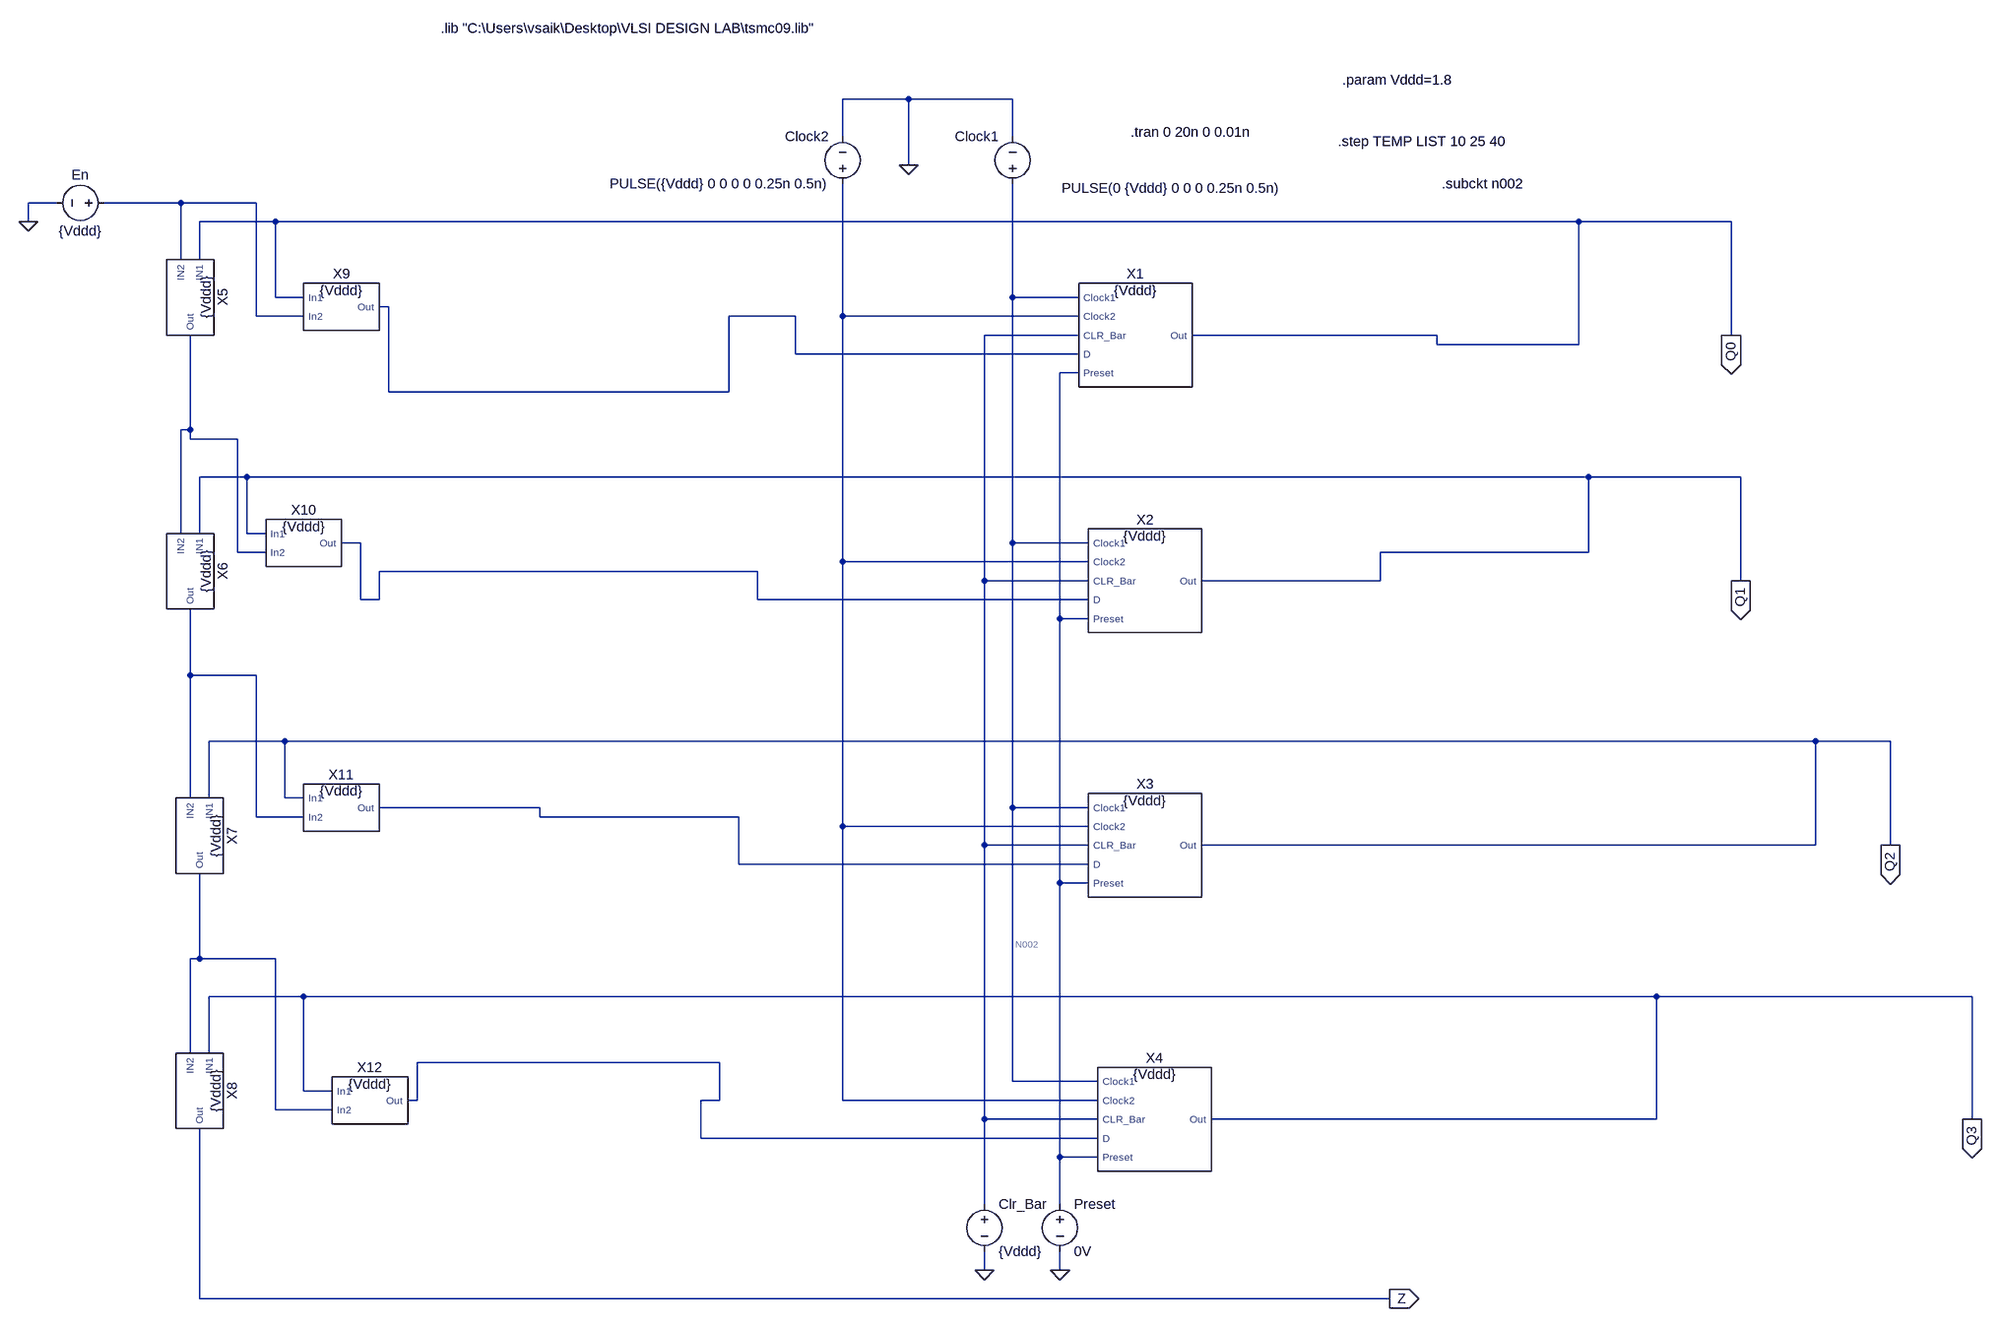
[diagram p0: schematic Counter1_P_Clr2_exper6.asc]
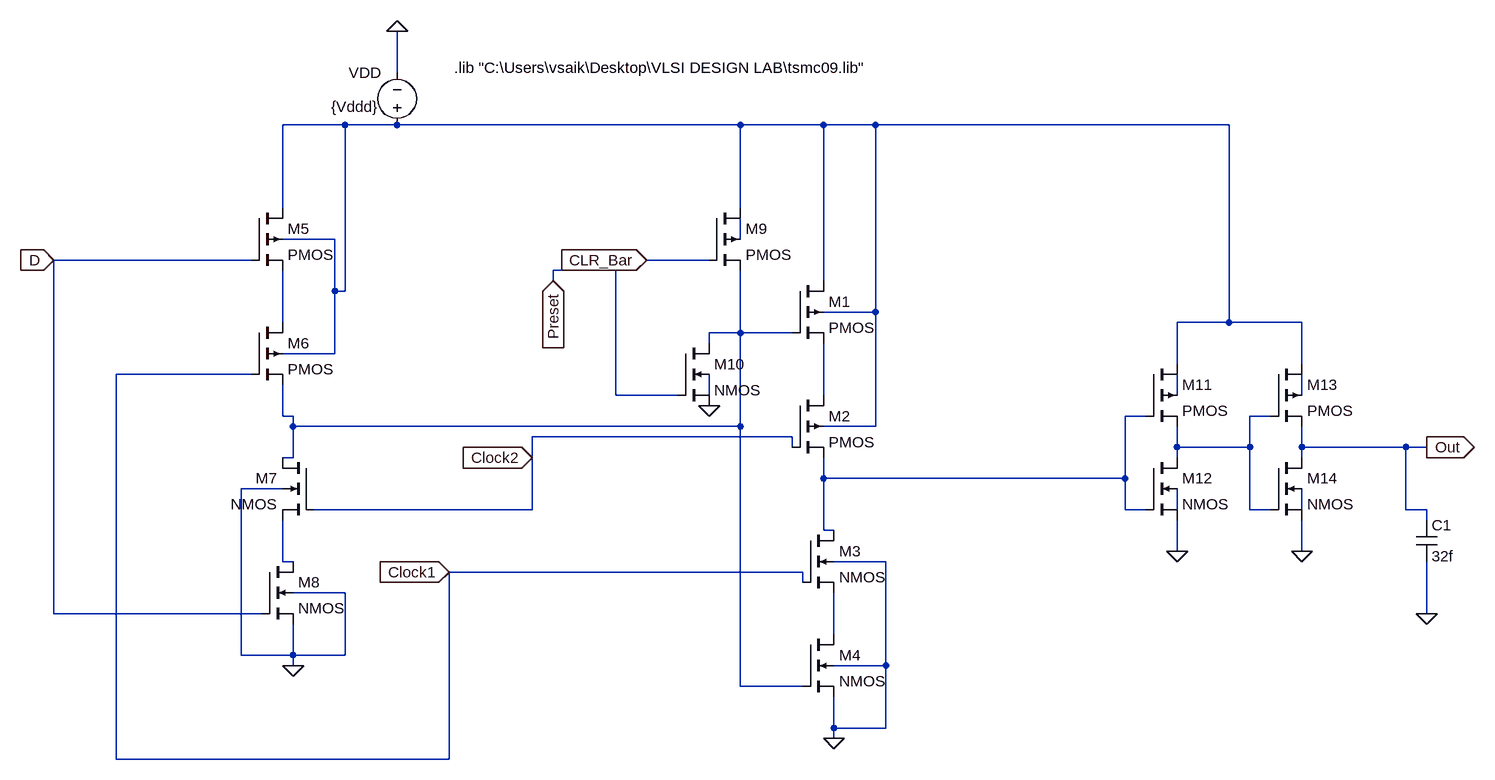
[diagram p1: sub-circuit d_flip_flop_880_440_buffer_pr_clr.asc]
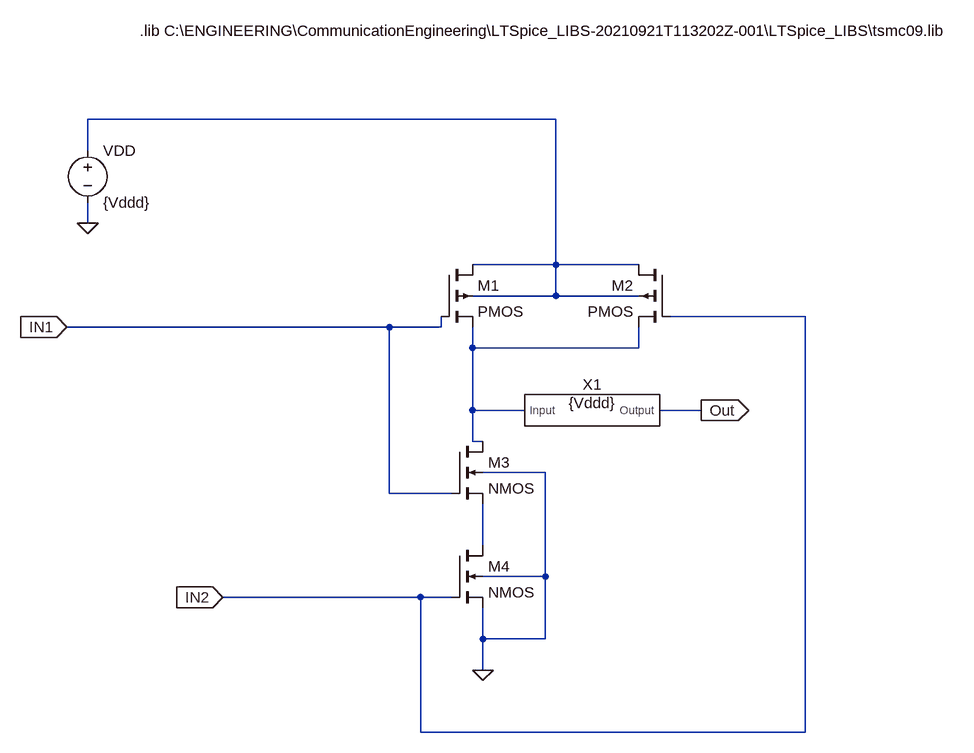
[diagram p2: sub-circuit and_model1.asc]
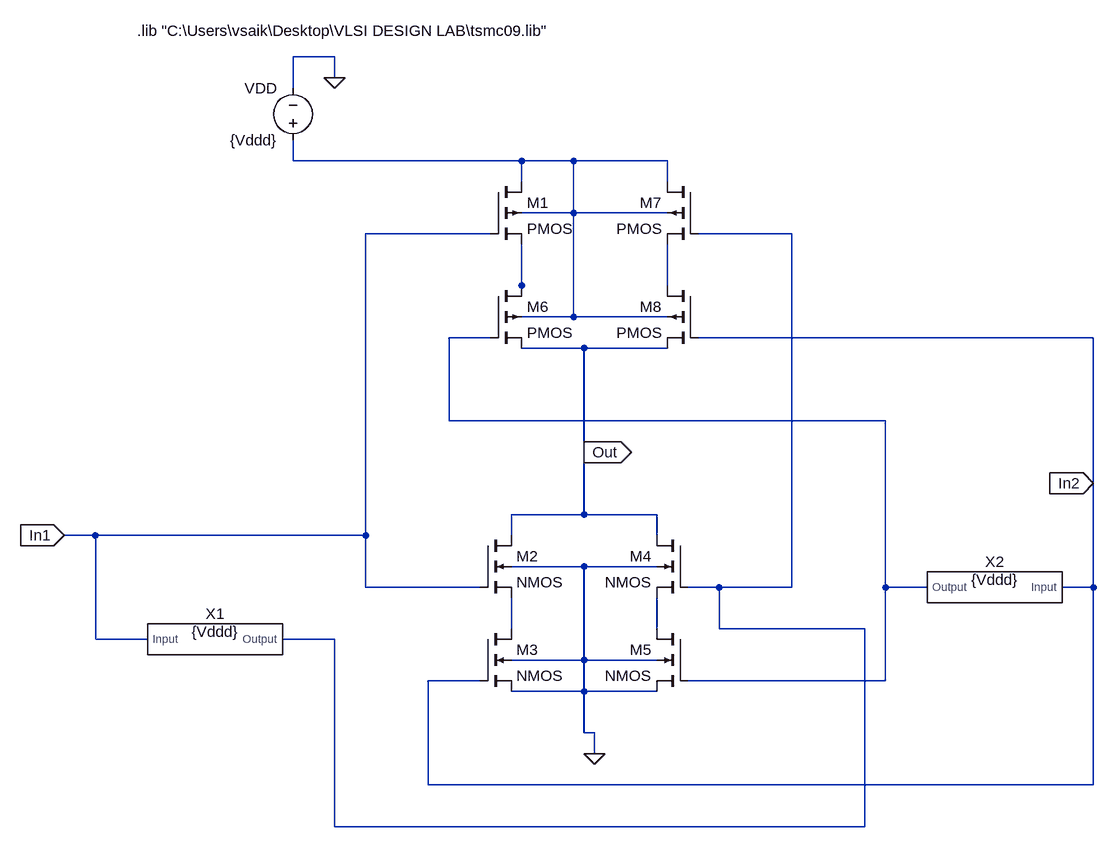
[diagram p3: sub-circuit xor_model1.asc]
Counter1_P_Clr2_exper6.asc, the LTspice schematic file:
Version 4
SHEET 1 3432 2288
WIRE 912 160 800 160
WIRE 1088 160 912 160
WIRE 800 224 800 160
WIRE 1088 224 1088 160
WIRE 912 272 912 160
WIRE -560 336 -608 336
WIRE -320 336 -480 336
WIRE -192 336 -320 336
WIRE -608 368 -608 336
WIRE -160 368 -288 368
WIRE 2128 368 -160 368
WIRE 2464 368 2128 368
WIRE -320 432 -320 336
WIRE -288 432 -288 368
WIRE -160 496 -160 368
WIRE -112 496 -160 496
WIRE 1088 496 1088 304
WIRE 1200 496 1088 496
WIRE 32 512 16 512
WIRE -192 528 -192 336
WIRE -112 528 -192 528
WIRE 720 528 608 528
WIRE 800 528 800 304
WIRE 1200 528 800 528
WIRE 1200 560 1040 560
WIRE 1888 560 1392 560
WIRE 2464 560 2464 368
WIRE 1888 576 1888 560
WIRE 2128 576 2128 368
WIRE 2128 576 1888 576
WIRE 720 592 720 528
WIRE 1200 592 720 592
WIRE 1200 624 1168 624
WIRE 32 656 32 512
WIRE 608 656 608 528
WIRE 608 656 32 656
WIRE -304 720 -304 560
WIRE -304 720 -320 720
WIRE -304 736 -304 720
WIRE -224 736 -304 736
WIRE -208 800 -288 800
WIRE 2144 800 -208 800
WIRE 2480 800 2144 800
WIRE -320 896 -320 720
WIRE -288 896 -288 800
WIRE -208 896 -208 800
WIRE -176 896 -208 896
WIRE -16 912 -48 912
WIRE 1088 912 1088 496
WIRE 1216 912 1088 912
WIRE -224 928 -224 736
WIRE -176 928 -224 928
WIRE 2144 928 2144 800
WIRE 2144 928 1792 928
WIRE 800 944 800 528
WIRE 1216 944 800 944
WIRE 656 960 16 960
WIRE 1040 976 1040 560
WIRE 1216 976 1040 976
WIRE 1792 976 1792 928
WIRE 1792 976 1408 976
WIRE 2480 976 2480 800
WIRE -16 1008 -16 912
WIRE 16 1008 16 960
WIRE 16 1008 -16 1008
WIRE 656 1008 656 960
WIRE 1216 1008 656 1008
WIRE 1168 1040 1168 624
WIRE 1216 1040 1168 1040
WIRE -304 1136 -304 1024
WIRE -192 1136 -304 1136
WIRE -144 1248 -272 1248
WIRE 2720 1248 -144 1248
WIRE 2992 1248 2720 1248
WIRE -304 1344 -304 1136
WIRE -272 1344 -272 1248
WIRE -144 1344 -144 1248
WIRE -112 1344 -144 1344
WIRE 288 1360 16 1360
WIRE 1088 1360 1088 912
WIRE 1216 1360 1088 1360
WIRE -192 1376 -192 1136
WIRE -112 1376 -192 1376
WIRE 288 1376 288 1360
WIRE 624 1376 288 1376
WIRE 800 1392 800 944
WIRE 1216 1392 800 1392
WIRE 1040 1424 1040 976
WIRE 1216 1424 1040 1424
WIRE 2720 1424 2720 1248
WIRE 2720 1424 1408 1424
WIRE 2992 1424 2992 1248
WIRE 624 1456 624 1376
WIRE 1216 1456 624 1456
WIRE 1168 1488 1168 1040
WIRE 1216 1488 1168 1488
WIRE -288 1616 -288 1472
WIRE -288 1616 -304 1616
WIRE -160 1616 -288 1616
WIRE -112 1680 -272 1680
WIRE 2336 1680 -112 1680
WIRE 3360 1680 2336 1680
WIRE -304 1776 -304 1616
WIRE -272 1776 -272 1680
WIRE 592 1792 80 1792
WIRE 1088 1824 1088 1360
WIRE 1232 1824 1088 1824
WIRE -112 1840 -112 1680
WIRE -64 1840 -112 1840
WIRE 80 1856 80 1792
WIRE 80 1856 64 1856
WIRE 592 1856 592 1792
WIRE 592 1856 560 1856
WIRE 800 1856 800 1392
WIRE 1232 1856 800 1856
WIRE -160 1872 -160 1616
WIRE -64 1872 -160 1872
WIRE 1040 1888 1040 1424
WIRE 1232 1888 1040 1888
WIRE 2336 1888 2336 1680
WIRE 2336 1888 1424 1888
WIRE 3360 1888 3360 1680
WIRE 560 1920 560 1856
WIRE 1232 1920 560 1920
WIRE 1168 1952 1168 1488
WIRE 1232 1952 1168 1952
WIRE 1040 2032 1040 1888
WIRE 1168 2032 1168 1952
WIRE 1040 2144 1040 2112
WIRE 1168 2144 1168 2112
WIRE -288 2192 -288 1904
WIRE 1808 2192 -288 2192
FLAG -608 368 0
FLAG 1040 2144 0
FLAG 1168 2144 0
FLAG 912 272 0
FLAG 1808 2192 Z
IOPIN 1808 2192 Out
FLAG 2464 560 Q0
IOPIN 2464 560 Out
FLAG 2480 976 Q1
IOPIN 2480 976 Out
FLAG 2992 1424 Q2
IOPIN 2992 1424 Out
FLAG 3360 1888 Q3
IOPIN 3360 1888 Out
SYMBOL D_Flip_Flop_880_440_buffer_Pr_Clr 1296 560 R0
WINDOW 39 0 -60 Bottom 2
SYMATTR InstName X1
SYMATTR SpiceLine {Vddd}
SYMATTR Prefix ""
SYMATTR Value ""
SYMBOL D_Flip_Flop_880_440_buffer_Pr_Clr 1312 976 R0
WINDOW 39 0 -60 Bottom 2
SYMATTR InstName X2
SYMATTR SpiceLine {Vddd}
SYMATTR Prefix ""
SYMATTR Value ""
SYMBOL D_Flip_Flop_880_440_buffer_Pr_Clr 1312 1424 R0
WINDOW 39 0 -60 Bottom 2
SYMATTR InstName X3
SYMATTR SpiceLine {Vddd}
SYMBOL D_Flip_Flop_880_440_buffer_Pr_Clr 1328 1888 R0
WINDOW 39 0 -60 Bottom 2
SYMATTR InstName X4
SYMATTR SpiceLine {Vddd}
SYMBOL AND_model1 -304 496 R90
WINDOW 39 0 -12 Bottom 2
SYMATTR InstName X5
SYMATTR SpiceLine {Vddd}
SYMBOL AND_model1 -304 960 R90
WINDOW 39 0 -12 Bottom 2
SYMATTR InstName X6
SYMATTR SpiceLine {Vddd}
SYMATTR Prefix ""
SYMATTR Value ""
SYMBOL AND_model1 -288 1408 R90
WINDOW 39 0 -12 Bottom 2
SYMATTR InstName X7
SYMATTR SpiceLine {Vddd}
SYMBOL AND_model1 -288 1840 R90
WINDOW 39 0 -12 Bottom 2
SYMATTR InstName X8
SYMATTR SpiceLine {Vddd}
SYMBOL XOR_model1 -48 512 R0
WINDOW 39 0 -12 Bottom 2
SYMATTR InstName X9
SYMATTR SpiceLine {Vddd}
SYMATTR Prefix ""
SYMATTR Value ""
SYMBOL XOR_model1 0 1856 R0
WINDOW 39 0 -12 Bottom 2
SYMATTR InstName X12
SYMATTR SpiceLine {Vddd}
SYMBOL voltage -464 336 R90
WINDOW 0 -32 56 VBottom 2
WINDOW 3 32 56 VTop 2
WINDOW 123 0 0 Left 0
WINDOW 39 0 0 Left 0
SYMATTR InstName En
SYMATTR Value {Vddd}
SYMBOL voltage 1088 320 R180
WINDOW 0 24 96 Left 2
WINDOW 3 -453 9 Left 2
WINDOW 123 0 0 Left 0
WINDOW 39 0 0 Left 0
SYMATTR InstName Clock1
SYMATTR Value PULSE(0 {Vddd} 0 0 0 0.25n 0.5n)
SYMBOL voltage 800 320 R180
WINDOW 0 24 96 Left 2
WINDOW 3 24 16 Left 2
WINDOW 123 0 0 Left 0
WINDOW 39 0 0 Left 0
SYMATTR InstName Clock2
SYMATTR Value PULSE({Vddd} 0 0 0 0 0.25n 0.5n)
SYMBOL voltage 1168 2016 R0
WINDOW 123 0 0 Left 0
WINDOW 39 0 0 Left 0
SYMATTR InstName Preset
SYMATTR Value 0V
SYMBOL voltage 1040 2016 R0
WINDOW 123 0 0 Left 0
WINDOW 39 0 0 Left 0
SYMATTR InstName Clr_Bar
SYMATTR Value {Vddd}
SYMBOL XOR_model1 -112 912 R0
WINDOW 39 0 -12 Bottom 2
SYMATTR InstName X10
SYMATTR SpiceLine {Vddd}
SYMBOL XOR_model1 -48 1360 R0
WINDOW 39 0 -12 Bottom 2
SYMATTR InstName X11
SYMATTR SpiceLine {Vddd}
TEXT 120 40 Left 2 !.lib "C:\\Users\\vsaik\\Desktop\\VLSI DESIGN LAB\\tsmc09.lib"
TEXT 1288 216 Left 2 !.tran 0 20n 0 0.01n
TEXT 1720 232 Left 2 !.step TEMP LIST 10 25 40
TEXT 1728 128 Left 2 !.param Vddd=1.8
TEXT 1896 304 Left 2 !.subckt n002

d_flip_flop_880_440_buffer_pr_clr.asc, the sub-circuit schematic file:
Version 4
SHEET 1 1644 1044
WIRE -160 -16 -160 -80
WIRE -240 64 -336 64
WIRE -160 64 -240 64
WIRE 368 64 -160 64
WIRE 496 64 368 64
WIRE 576 64 496 64
WIRE 1120 64 576 64
WIRE -336 192 -336 64
WIRE 368 192 368 64
WIRE -256 240 -336 240
WIRE 368 240 368 208
WIRE -384 272 -688 272
WIRE 320 272 224 272
WIRE 176 288 80 288
WIRE 80 304 80 288
WIRE 496 304 496 64
WIRE -256 320 -256 240
WIRE -240 320 -240 64
WIRE -240 320 -256 320
WIRE 576 352 576 64
WIRE 576 352 496 352
WIRE -336 368 -336 288
WIRE 1120 368 1120 64
WIRE 1120 368 1040 368
WIRE 1232 368 1120 368
WIRE 368 384 368 288
WIRE 368 384 320 384
WIRE 448 384 368 384
WIRE 320 400 320 384
WIRE -256 416 -256 320
WIRE -256 416 -336 416
WIRE 1040 432 1040 368
WIRE 1232 432 1232 368
WIRE -384 448 -592 448
WIRE 176 480 176 288
WIRE 272 480 176 480
WIRE 320 480 320 448
WIRE 496 480 496 400
WIRE 1040 480 1040 448
WIRE 1232 480 1232 448
WIRE -336 512 -336 464
WIRE -320 512 -336 512
WIRE 992 512 960 512
WIRE 1184 512 1152 512
WIRE -320 528 -320 512
WIRE 368 528 368 384
WIRE 368 528 -320 528
WIRE 576 528 576 352
WIRE 576 528 496 528
WIRE 448 544 48 544
WIRE 448 560 448 544
WIRE 1040 560 1040 528
WIRE 1152 560 1152 512
WIRE 1152 560 1040 560
WIRE 1232 560 1232 528
WIRE 1392 560 1232 560
WIRE 1424 560 1392 560
WIRE -320 576 -320 528
WIRE -320 576 -336 576
WIRE 48 576 48 544
WIRE 1040 576 1040 560
WIRE 1232 576 1232 560
WIRE 496 608 496 576
WIRE 960 608 960 512
WIRE 960 608 496 608
WIRE -336 624 -400 624
WIRE 48 656 48 576
WIRE 48 656 -288 656
WIRE 960 656 960 608
WIRE 992 656 960 656
WIRE 1040 656 1040 624
WIRE 1152 656 1152 560
WIRE 1184 656 1152 656
WIRE 1232 656 1232 624
WIRE 1392 656 1392 560
WIRE 1424 656 1392 656
WIRE 1424 672 1424 656
WIRE 496 688 496 608
WIRE 512 688 496 688
WIRE 1040 720 1040 672
WIRE 1232 720 1232 672
WIRE -336 736 -336 672
WIRE -320 736 -336 736
WIRE 592 736 512 736
WIRE 464 752 -80 752
WIRE 464 768 464 752
WIRE -240 784 -320 784
WIRE -688 816 -688 272
WIRE -368 816 -688 816
WIRE 1424 816 1424 736
WIRE 512 848 512 784
WIRE -400 880 -400 624
WIRE -320 880 -320 832
WIRE -320 880 -400 880
WIRE -240 880 -240 784
WIRE -240 880 -320 880
WIRE -320 896 -320 880
WIRE 592 896 592 736
WIRE 592 896 512 896
WIRE 368 928 368 528
WIRE 464 928 368 928
WIRE 512 992 512 944
WIRE 592 992 592 896
WIRE 592 992 512 992
WIRE 512 1008 512 992
WIRE -592 1040 -592 448
WIRE -80 1040 -80 752
WIRE -80 1040 -592 1040
FLAG -160 -80 0
FLAG 512 1008 0
FLAG 1424 816 0
FLAG -320 896 0
FLAG 320 496 0
FLAG 1232 720 0
FLAG 1040 720 0
FLAG -688 272 D
IOPIN -688 272 In
FLAG -80 752 Clock1
IOPIN -80 752 In
FLAG 48 576 Clock2
IOPIN 48 576 In
FLAG 1424 560 Out
IOPIN 1424 560 Out
FLAG 80 304 Preset
IOPIN 80 304 In
FLAG 224 272 CLR_Bar
IOPIN 224 272 In
SYMBOL pmos4 448 304 R0
SYMATTR InstName M1
SYMATTR Value2 l=90n w=440n
SYMBOL pmos4 448 480 R0
SYMATTR InstName M2
SYMATTR Value2 l=90n w=440n
SYMBOL nmos4 464 688 R0
SYMATTR InstName M3
SYMATTR Value2 l=90n w=220n
SYMBOL nmos4 464 848 R0
SYMATTR InstName M4
SYMATTR Value2 l=90n w=220n
SYMBOL voltage -160 80 R180
WINDOW 0 24 96 Left 2
WINDOW 3 29 44 Left 2
SYMATTR InstName VDD
SYMATTR Value {Vddd}
SYMBOL cap 1408 672 R0
SYMATTR InstName C1
SYMATTR Value 32f
SYMBOL pmos4 -384 192 R0
SYMATTR InstName M5
SYMATTR Value2 l=90n w=440n
SYMBOL pmos4 -384 368 R0
SYMATTR InstName M6
SYMATTR Value2 l=90n w=440n
SYMBOL nmos4 -288 576 M0
SYMATTR InstName M7
SYMATTR Value2 l=90n w=220n
SYMBOL nmos4 -368 736 R0
SYMATTR InstName M8
SYMATTR Value2 l=90n w=220n
SYMBOL pmos4 320 192 R0
SYMATTR InstName M9
SYMATTR Value2 l=90n w=440n
SYMBOL nmos4 272 400 R0
SYMATTR InstName M10
SYMATTR Value2 l=90n w=220n
SYMBOL pmos4 992 432 R0
SYMATTR InstName M11
SYMATTR Value2 l=90n w=440n
SYMBOL nmos4 992 576 R0
SYMATTR InstName M12
SYMATTR Value2 l=90n w=220n
SYMBOL pmos4 1184 432 R0
SYMATTR InstName M13
SYMATTR Value2 l=90n w=440n
SYMBOL nmos4 1184 576 R0
SYMATTR InstName M14
SYMATTR Value2 l=90n w=220n
TEXT -72 -24 Left 2 !.lib "C:\\Users\\vsaik\\Desktop\\VLSI DESIGN LAB\\tsmc09.lib"

and_model1.asc, the sub-circuit schematic file:
Version 4
SHEET 1 1644 1012
WIRE 912 64 192 64
WIRE 192 112 192 64
WIRE 192 224 192 192
WIRE 912 288 912 64
WIRE 912 288 784 288
WIRE 1040 288 912 288
WIRE 912 336 912 288
WIRE 912 336 784 336
WIRE 1040 336 912 336
WIRE 1296 368 1088 368
WIRE 656 384 160 384
WIRE 736 384 736 368
WIRE 736 384 656 384
WIRE 784 416 784 384
WIRE 1040 416 1040 384
WIRE 1040 416 784 416
WIRE 784 512 784 416
WIRE 864 512 784 512
WIRE 1136 512 1072 512
WIRE 784 560 784 512
WIRE 800 560 784 560
WIRE 896 608 800 608
WIRE 656 640 656 384
WIRE 752 640 656 640
WIRE 800 720 800 656
WIRE 896 768 896 608
WIRE 896 768 800 768
WIRE 704 800 400 800
WIRE 752 800 704 800
WIRE 800 864 800 816
WIRE 896 864 896 768
WIRE 896 864 800 864
WIRE 800 912 800 864
WIRE 704 1008 704 800
WIRE 1296 1008 1296 368
WIRE 1296 1008 704 1008
FLAG 192 224 0
FLAG 800 912 0
FLAG 1136 512 Out
IOPIN 1136 512 Out
FLAG 160 384 IN1
IOPIN 160 384 In
FLAG 400 800 IN2
IOPIN 400 800 In
SYMBOL pmos4 736 288 R0
SYMATTR InstName M1
SYMATTR Value2 l=90n w=440n
SYMBOL pmos4 1088 288 M0
SYMATTR InstName M2
SYMATTR Value2 l=90n w=440n
SYMBOL nmos4 752 560 R0
SYMATTR InstName M3
SYMATTR Value2 l=90n w=220n
SYMBOL nmos4 752 720 R0
SYMATTR InstName M4
SYMATTR Value2 l=90n w=220n
SYMBOL voltage 192 96 R0
SYMATTR InstName VDD
SYMATTR Value {Vddd}
SYMBOL NOT_model1 960 512 R0
WINDOW 39 8 4 Bottom 2
SYMATTR SpiceLine {Vddd}
SYMATTR InstName X1
TEXT 272 -72 Left 2 !.lib C:\\ENGINEERING\\CommunicationEngineering\\LTSpice_LIBS-20210921T113202Z-001\\LTSpice_LIBS\\tsmc09.lib

xor_model1.asc, the sub-circuit schematic file:
Version 4
SHEET 1 2196 1236
WIRE 480 48 416 48
WIRE 480 80 480 48
WIRE 416 96 416 48
WIRE 416 208 416 176
WIRE 768 208 416 208
WIRE 848 208 768 208
WIRE 992 208 848 208
WIRE 768 240 768 208
WIRE 992 240 992 208
WIRE 848 288 848 208
WIRE 848 288 768 288
WIRE 992 288 848 288
WIRE 720 320 528 320
WIRE 1184 320 1040 320
WIRE 768 400 768 336
WIRE 992 400 992 336
WIRE 768 416 768 400
WIRE 848 448 848 288
WIRE 848 448 768 448
WIRE 992 448 848 448
WIRE 720 480 656 480
WIRE 1648 480 1040 480
WIRE 864 496 768 496
WIRE 992 496 864 496
WIRE 656 608 656 480
WIRE 1328 608 656 608
WIRE 864 656 864 496
WIRE 1648 704 1648 480
WIRE 864 752 864 656
WIRE 864 752 752 752
WIRE 976 752 864 752
WIRE 112 784 64 784
WIRE 528 784 528 320
WIRE 528 784 112 784
WIRE 752 784 752 752
WIRE 976 784 976 752
WIRE 864 832 752 832
WIRE 976 832 864 832
WIRE 528 864 528 784
WIRE 704 864 528 864
WIRE 1072 864 1024 864
WIRE 1184 864 1184 320
WIRE 1184 864 1072 864
WIRE 1328 864 1328 608
WIRE 1392 864 1328 864
WIRE 1648 864 1648 704
WIRE 1648 864 1600 864
WIRE 752 928 752 880
WIRE 976 928 976 880
WIRE 1072 928 1072 864
WIRE 1296 928 1072 928
WIRE 112 944 112 784
WIRE 192 944 112 944
WIRE 480 944 400 944
WIRE 864 976 864 832
WIRE 864 976 752 976
WIRE 976 976 864 976
WIRE 704 1008 624 1008
WIRE 1328 1008 1328 864
WIRE 1328 1008 1024 1008
WIRE 864 1024 864 976
WIRE 864 1024 752 1024
WIRE 976 1024 864 1024
WIRE 864 1088 864 1024
WIRE 880 1088 864 1088
WIRE 880 1120 880 1088
WIRE 624 1168 624 1008
WIRE 1648 1168 1648 864
WIRE 1648 1168 624 1168
WIRE 480 1232 480 944
WIRE 1296 1232 1296 928
WIRE 1296 1232 480 1232
FLAG 480 80 0
FLAG 880 1120 0
FLAG 64 784 In1
IOPIN 64 784 In
FLAG 1648 704 In2
IOPIN 1648 704 In
FLAG 864 656 Out
IOPIN 864 656 Out
SYMBOL pmos4 720 240 R0
SYMATTR InstName M1
SYMATTR Value2 l=90n w=440n
SYMBOL nmos4 704 784 R0
SYMATTR InstName M2
SYMATTR Value2 l=90n w=220n
SYMBOL nmos4 704 928 R0
SYMATTR InstName M3
SYMATTR Value2 l=90n w=220n
SYMBOL nmos4 1024 784 M0
SYMATTR InstName M4
SYMATTR Value2 l=90n w=220n
SYMBOL nmos4 1024 928 M0
SYMATTR InstName M5
SYMATTR Value2 l=90n w=220n
SYMBOL voltage 416 192 R180
WINDOW 0 24 96 Left 2
WINDOW 3 24 16 Left 2
SYMATTR InstName VDD
SYMATTR Value {Vddd}
SYMBOL pmos4 720 400 R0
SYMATTR InstName M6
SYMATTR Value2 l=90n w=440n
SYMBOL pmos4 1040 240 M0
SYMATTR InstName M7
SYMATTR Value2 l=90n w=440n
SYMBOL pmos4 1040 400 M0
SYMATTR InstName M8
SYMATTR Value2 l=90n w=440n
SYMBOL NOT_model1 288 944 R0
WINDOW 39 8 4 Bottom 2
SYMATTR InstName X1
SYMATTR SpiceLine {Vddd}
SYMBOL NOT_model1 1504 864 M0
WINDOW 39 8 4 Bottom 2
SYMATTR InstName X2
SYMATTR SpiceLine {Vddd}
TEXT 176 8 Left 2 !.lib "C:\\Users\\vsaik\\Desktop\\VLSI DESIGN LAB\\tsmc09.lib"

The netlist it stands for:
* Counter1_P_Clr2_exper6.asc
XX1 N002 N004 N005 N003 N006 Q0 d_flip_flop_880_440_buffer_pr_clr params: {Vddd}
XX2 N002 N004 N005 N008 N006 Q1 d_flip_flop_880_440_buffer_pr_clr params: {Vddd}
XX3 N002 N004 N005 N010 N006 Q2 DFF0 {Vddd}  ; pins Clock1 Clock2 CLR_Bar D Preset Out
XX4 N002 N004 N005 N012 N006 Q3 DFF0 {Vddd}  ; pins Clock1 Clock2 CLR_Bar D Preset Out
XX5 Q0 N001 N007 AND0 {Vddd}  ; pins IN1 IN2 Out
XX6 Q1 N007 N009 and_model1 params: {Vddd}
XX7 Q2 N009 N011 AND0 {Vddd}  ; pins IN1 IN2 Out
XX8 Q3 N011 Z AND0 {Vddd}  ; pins IN1 IN2 Out
XX9 Q0 N001 N003 xor_model1 params: {Vddd}
XX12 Q3 N011 N012 XOR0 {Vddd}  ; pins In1 In2 Out
V§En N001 0 {Vddd}
V§Clock1 N002 0 PULSE(0 {Vddd} 0 0 0 0.25n 0.5n)
V§Clock2 N004 0 PULSE({Vddd} 0 0 0 0 0.25n 0.5n)
V§Preset N006 0 0V
V§Clr_Bar N005 0 {Vddd}
XX10 Q1 N007 N008 XOR0 {Vddd}  ; pins In1 In2 Out
XX11 Q2 N009 N010 XOR0 {Vddd}  ; pins In1 In2 Out

* block symbol definitions
.subckt d_flip_flop_880_440_buffer_pr_clr Clock1 Clock2 CLR_Bar D Preset Out
M1 N001 N004 N006 N001 PMOS l=90n w=440n
M2 N006 Clock2 N009 N001 PMOS l=90n w=440n
M3 N009 Clock1 N014 0 NMOS l=90n w=220n
M4 N014 N004 0 0 NMOS l=90n w=220n
VDD N001 0 {Vddd}
C1 Out 0 32f
M5 N001 D N003 N001 PMOS l=90n w=440n
M6 N003 Clock1 N004 N001 PMOS l=90n w=440n
M7 N004 Clock2 N013 0 NMOS l=90n w=220n
M8 N013 D 0 0 NMOS l=90n w=220n
M9 N001 CLR_Bar N004 N002 PMOS l=90n w=440n
M10 N004 Preset 0 N005 NMOS l=90n w=220n
M11 N001 N009 N010 N007 PMOS l=90n w=440n
M12 N010 N009 0 N011 NMOS l=90n w=220n
M13 N001 N010 Out N008 PMOS l=90n w=440n
M14 Out N010 0 N012 NMOS l=90n w=220n
.lib "C:\Users\vsaik\Desktop\VLSI DESIGN LAB\tsmc09.lib"
.ends d_flip_flop_880_440_buffer_pr_clr

.subckt and_model1 IN1 IN2 Out
M1 N001 IN1 N002 N001 PMOS l=90n w=440n
M2 N001 IN2 N002 N001 PMOS l=90n w=440n
M3 N002 IN1 N003 0 NMOS l=90n w=220n
M4 N003 IN2 0 0 NMOS l=90n w=220n
VDD N001 0 {Vddd}
XX1 N002 Out NOT0 {Vddd}  ; pins Input Output
.lib C:\ENGINEERING\CommunicationEngineering\LTSpice_LIBS-20210921T113202Z-001\LTSpice_LIBS\tsmc09.lib
.ends and_model1

.subckt xor_model1 In1 In2 Out
M1 N001 In1 N003 N001 PMOS l=90n w=440n
M2 Out In1 N006 0 NMOS l=90n w=220n
M3 N006 In2 0 0 NMOS l=90n w=220n
M4 Out N002 N007 0 NMOS l=90n w=220n
M5 N007 N005 0 0 NMOS l=90n w=220n
VDD N001 0 {Vddd}
M6 N003 N005 Out N001 PMOS l=90n w=440n
M7 N001 N002 N004 N001 PMOS l=90n w=440n
M8 N004 In2 Out N001 PMOS l=90n w=440n
XX1 In1 N002 NOT0 {Vddd}  ; pins Input Output
XX2 In2 N005 NOT0 {Vddd}  ; pins Input Output
.lib "C:\Users\vsaik\Desktop\VLSI DESIGN LAB\tsmc09.lib"
.ends xor_model1

.model NMOS NMOS
.model PMOS PMOS
.lib standard.mos
.lib "C:\Users\vsaik\Desktop\VLSI DESIGN LAB\tsmc09.lib"
.tran 0 20n 0 0.01n
.step TEMP LIST 10 25 40
.param Vddd=1.8
.subckt n002
.backanno
.end